# EAGLE design LEDMatrixLearningBadge (EAGLE 6.5.0)
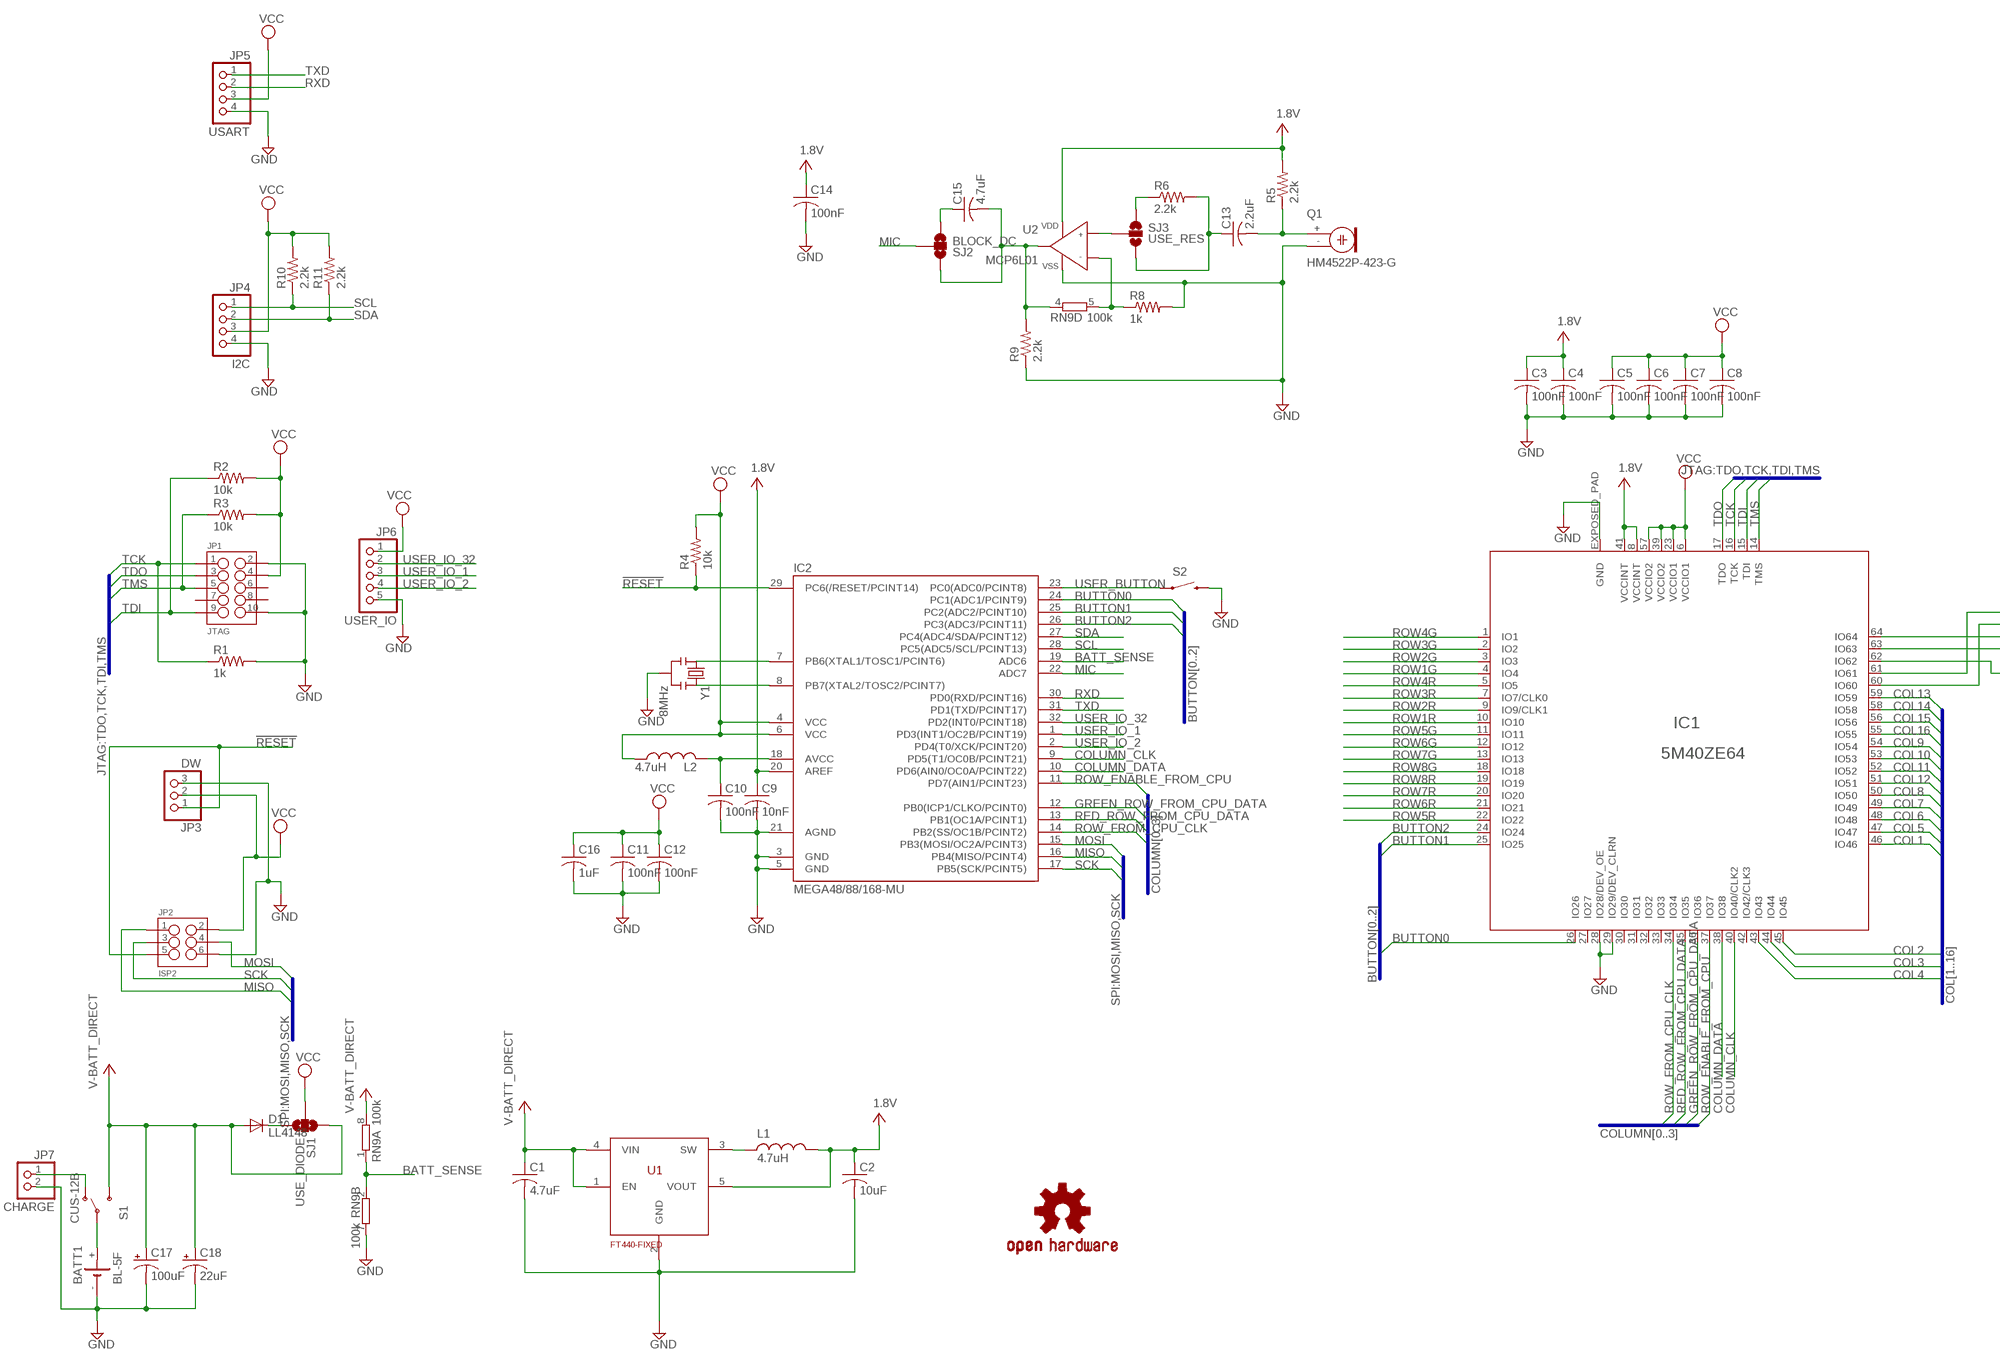
[diagram p0: schematic, sheet 1, part 1 of 2]
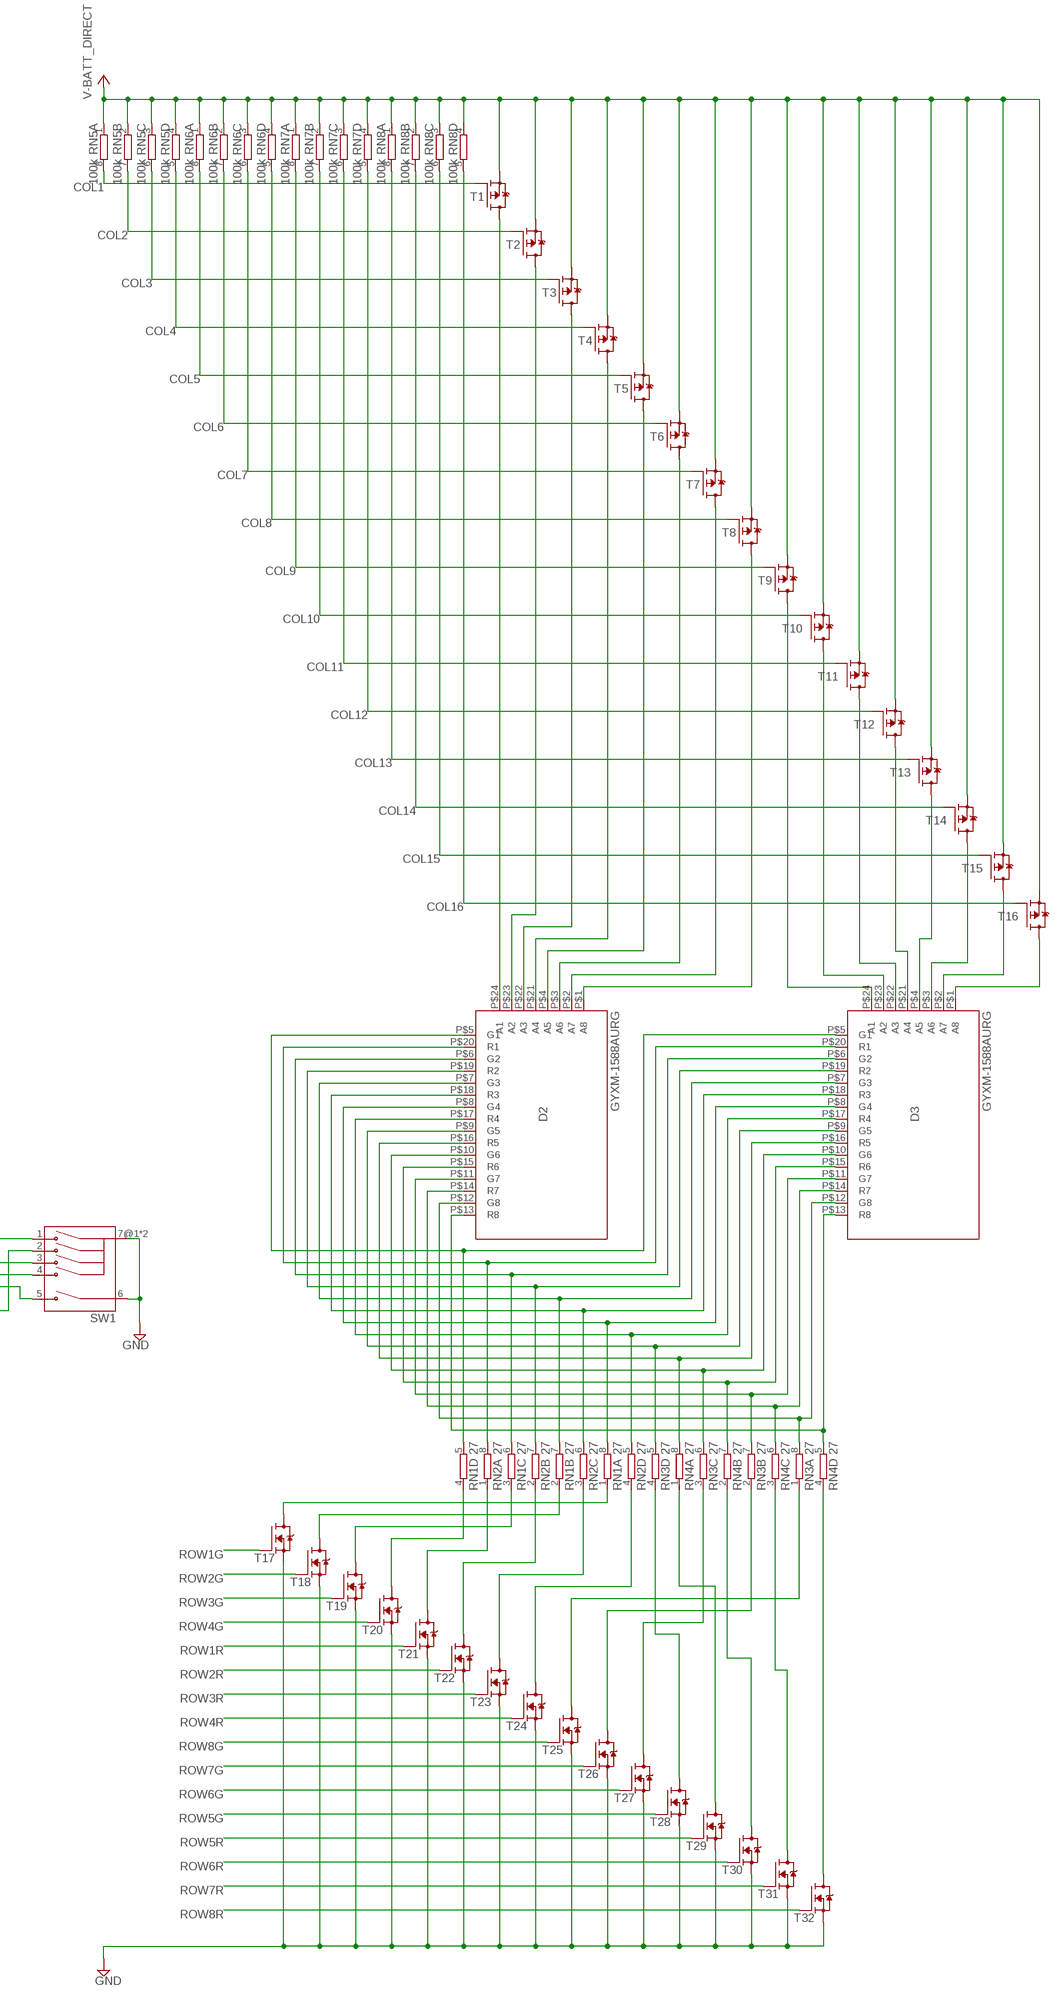
[diagram p1: schematic, sheet 1, part 2 of 2]

## Parts
BATT1  BL-5F  1C  [NOKIA_BL-5F_INCL_HOLDER]
C1  4.7uF  C-USC0603  [C0603]
C2  10uF  C0508  [C0508]
C3  100nF  C-USC0603  [C0603]
C4  100nF  C-USC0603  [C0603]
C5  100nF  C-USC0603  [C0603]
C6  100nF  C-USC0603  [C0603]
C7  100nF  C-USC0603  [C0603]
C8  100nF  C-USC0603  [C0603]
C9  10nF  C-USC0603  [C0603]
C10  100nF  C-USC0603  [C0603]
C11  100nF  C-USC0603  [C0603]
C12  100nF  C-USC0603  [C0603]
C13  2.2uF  C-USC0603  [C0603]
C14  100nF  C-USC0603  [C0603]
C15  4.7uF  C-USC0603  [C0603]
C16  1uF  C-USC0603  [C0603]
C17  100uF  CPOL-USC/6032-28R  [C/6032-28R]
C18  22uF  CPOL-USD/7343-31R  [D/7343-31R]
D1  LL4148  DIODE-SOD80C  [SOD80C]
D2  GYXM-1588AURG  [GYXM-1588AURG]
D3  GYXM-1588AURG  [GYXM-1588AURG]
IC1  5M40ZE64  [EQFP64]
IC2  MEGA48/88/168-MU  [MLF32]
JP1  JTAG  M05X2  [2X5_POGO]
JP2  ISP2  M03X2POGO_PINS  [2X3_POGO]
JP3  DW  PINHD-1X3  [1X03]
JP4  I2C  PINHD-1X4  [1X04]
JP5  USART  PINHD-1X4  [1X04]
JP6  USER_IO  PINHD-1X5  [1X05]
JP7  CHARGE  PINHD-1X2  [1X02]
L1  4.7uH  INDUCTOR0603  [0603]
L2  4.7uH  INDUCTOR0603  [0603]
LOGO1  OSHW-LOGOS  [OSHW-LOGO-S]
Q1  HM4522P-423-G  ELECTRET4.5MM  [4.5ELECTRET]
R1  1k  R-US_R0603  [R0603]
R2  10k  R-US_R0603  [R0603]
R3  10k  R-US_R0603  [R0603]
R4  10k  R-US_R0603  [R0603]
R5  2.2k  R-US_R0603  [R0603]
R6  2.2k  R-US_R0603  [R0603]
R8  1k  R-US_R0603  [R0603]
R9  2.2k  R-US_R0603  [R0603]
R10  2.2k  R-US_R0603  [R0603]
R11  2.2k  R-US_R0603  [R0603]
RN1  27  4R-N0603-ARV  [0603-ARV]
RN2  27  4R-N0603-ARV  [0603-ARV]
RN3  27  4R-N0603-ARV  [0603-ARV]
RN4  27  4R-N0603-ARV  [0603-ARV]
RN5  100k  4R-N0603-ARV  [0603-ARV]
RN6  100k  4R-N0603-ARV  [0603-ARV]
RN7  100k  4R-N0603-ARV  [0603-ARV]
RN8  100k  4R-N0603-ARV  [0603-ARV]
RN9  100k  4R-N0603-ARV  [0603-ARV]
S1  CUS-12B  SWITCH-SPDT-SMD-A  [SWITCH-SPST-SMD-A]
S2  SWITCH-MOMENTARY-212MM  [TACTILE-PTH-12MM]
SJ1  USE_DIODE  SOLDERJUMPER_2WAYPASTE1&2  [SJ_3_PASTE1&2]
SJ2  BLOCK_DC  SOLDERJUMPER_2WAYPASTE1&2  [SJ_3_PASTE1&2]
SJ3  USE_RES  SOLDERJUMPER_2WAYPASTE1&2  [SJ_3_PASTE1&2]
SW1  4_DIRECTIONAL_JOYSTICK_PLUS_CENTER  [EVQWH]
T1  ZXM61P03  P-MOSFET  [SOT23]
T2  ZXM61P03  P-MOSFET  [SOT23]
T3  ZXM61P03  P-MOSFET  [SOT23]
T4  ZXM61P03  P-MOSFET  [SOT23]
T5  ZXM61P03  P-MOSFET  [SOT23]
T6  ZXM61P03  P-MOSFET  [SOT23]
T7  ZXM61P03  P-MOSFET  [SOT23]
T8  ZXM61P03  P-MOSFET  [SOT23]
T9  ZXM61P03  P-MOSFET  [SOT23]
T10  ZXM61P03  P-MOSFET  [SOT23]
T11  ZXM61P03  P-MOSFET  [SOT23]
T12  ZXM61P03  P-MOSFET  [SOT23]
T13  ZXM61P03  P-MOSFET  [SOT23]
T14  ZXM61P03  P-MOSFET  [SOT23]
T15  ZXM61P03  P-MOSFET  [SOT23]
T16  ZXM61P03  P-MOSFET  [SOT23]
T17  DMN65D8L  N-MOSFET  [SOT23]
T18  DMN65D8L  N-MOSFET  [SOT23]
T19  DMN65D8L  N-MOSFET  [SOT23]
T20  DMN65D8L  N-MOSFET  [SOT23]
T21  DMN65D8L  N-MOSFET  [SOT23]
T22  DMN65D8L  N-MOSFET  [SOT23]
T23  DMN65D8L  N-MOSFET  [SOT23]
T24  DMN65D8L  N-MOSFET  [SOT23]
T25  DMN65D8L  N-MOSFET  [SOT23]
T26  DMN65D8L  N-MOSFET  [SOT23]
T27  DMN65D8L  N-MOSFET  [SOT23]
T28  DMN65D8L  N-MOSFET  [SOT23]
T29  DMN65D8L  N-MOSFET  [SOT23]
T30  DMN65D8L  N-MOSFET  [SOT23]
T31  DMN65D8L  N-MOSFET  [SOT23]
T32  DMN65D8L  N-MOSFET  [SOT23]
U1  FT440-FIXED  [SOT23-5]
U2  MCP6L01  [SOT23-5]
Y1  8MHz  RESONATOR  [RESONATOR-SMD]

## Nets
1.8V: C2.P$1 C3.1 C4.1 C9.1 C14.1 IC1.8(VCCINT) IC1.41(VCCINT) IC2.20(AREF) L1.2 R5.2 U1.5(VOUT) U2.P5(VDD)
!RESET: IC2.29(PC6(/RESET/PCINT14)) JP2.P$5 JP3.1 R4.1
+V-BATT_DIRECT: C1.1 C17.+ C18.+ D1.A RN5.1 RN5.2 RN5.3 RN5.4 RN6.1 RN6.2 RN6.3 RN6.4 RN7.1 RN7.2 RN7.3 RN7.4 RN8.1 RN8.2 RN8.3 RN8.4 RN9.8 S1.3(S) SJ1.1 T1.2(S) T2.2(S) T3.2(S) T4.2(S) T5.2(S) T6.2(S) T7.2(S) T8.2(S) T9.2(S) T10.2(S) T11.2(S) T12.2(S) T13.2(S) T14.2(S) T15.2(S) T16.2(S) U1.1(EN) U1.4(VIN) ; supply symbol labelled V-BATT_DIRECT
BATT_SENSE: IC2.19(ADC6) RN9.1 RN9.2
BUTTON0: IC1.26(IO26) IC2.24(PC1(ADC1/PCINT9))
BUTTON1: IC1.25(IO25) IC2.25(PC2(ADC2/PCINT10))
BUTTON2: IC1.24(IO24) IC2.26(PC3(ADC3/PCINT11))
COL1: IC1.46(IO46) RN5.8 T1.1(G)
COL2: IC1.45(IO45) RN5.7 T2.1(G)
COL3: IC1.44(IO44) RN5.6 T3.1(G)
COL4: IC1.43(IO43) RN5.5 T4.1(G)
COL5: IC1.47(IO47) RN6.8 T5.1(G)
COL6: IC1.48(IO48) RN6.7 T6.1(G)
COL7: IC1.49(IO49) RN6.6 T7.1(G)
COL8: IC1.50(IO50) RN6.5 T8.1(G)
COL9: IC1.54(IO54) RN7.8 T9.1(G)
COL10: IC1.53(IO53) RN7.7 T10.1(G)
COL11: IC1.52(IO52) RN7.6 T11.1(G)
COL12: IC1.51(IO51) RN7.5 T12.1(G)
COL13: IC1.59(IO59) RN8.8 T13.1(G)
COL14: IC1.58(IO58) RN8.7 T14.1(G)
COL15: IC1.56(IO56) RN8.6 T15.1(G)
COL16: IC1.55(IO55) RN8.5 T16.1(G)
COLUMN_CLK: IC1.40(IO40/CLK2) IC2.9(PD5(T1/OC0B/PCINT21))
COLUMN_DATA: IC1.38(IO38) IC2.10(PD6(AIN0/OC0A/PCINT22))
GND: BATT1.- C1.2 C2.P$2 C3.2 C4.2 C5.2 C6.2 C7.2 C8.2 C9.2 C10.2 C11.2 C12.2 C14.2 C16.2 C17.- C18.- IC1.28(IO28/DEV_OE) IC1.29(IO29/DEV_CLRN) IC1.EXPOSED_PAD(GND) IC2.3(GND) IC2.5(GND) IC2.21(AGND) JP1.P$2 JP1.P$10 JP2.P$6 JP3.3 JP4.4 JP5.4 JP6.5 JP7.2 Q1.- R1.2 R8.2 R9.1 RN9.7 S2.3 SW1.6 SW1.7@1 SW1.7@2 T17.2(S) T18.2(S) T19.2(S) T20.2(S) T21.2(S) T22.2(S) T23.2(S) T24.2(S) T25.2(S) T26.2(S) T27.2(S) T28.2(S) T29.2(S) T30.2(S) T31.2(S) T32.2(S) U1.2(GND) U2.P2(VSS) Y1.2
GREEN_ROW_FROM_CPU_DATA: IC1.36(IO36) IC2.12(PB0(ICP1/CLKO/PCINT0))
MIC: IC2.22(ADC7) SJ2.2
MISO: IC2.16(PB4(MISO/PCINT4)) JP2.P$1
MOSI: IC2.15(PB3(MOSI/OC2A/PCINT3)) JP2.P$4
N$1: SJ3.2 U2.P3(IN+)
N$2: C13.2 Q1.+ R5.1
N$3: R6.1 SJ3.1
N$4: R8.1 RN9.5 U2.P4(IN-)
N$5: C15.1 SJ2.3
N$6: C15.2 R9.2 RN9.4 SJ2.1 U2.P1(OUT)
N$7: C13.1 R6.2 SJ3.3
N$8: D2.P$1(A8) T8.3(D)
N$9: D1.C SJ1.3
N$10: L1.1 U1.3(SW)
N$11: C10.1 IC2.18(AVCC) L2.2
N$12: D2.P$2(A7) T7.3(D)
N$13: D2.P$3(A6) T6.3(D)
N$14: D2.P$4(A5) T5.3(D)
N$15: D2.P$21(A4) T4.3(D)
N$16: D2.P$22(A3) T3.3(D)
N$17: D2.P$23(A2) T2.3(D)
N$18: D2.P$24(A1) T1.3(D)
N$19: D3.P$24(A1) T9.3(D)
N$20: D3.P$1(A8) T16.3(D)
N$21: D3.P$2(A7) T15.3(D)
N$22: D3.P$3(A6) T14.3(D)
N$23: D3.P$4(A5) T13.3(D)
N$24: D3.P$21(A4) T12.3(D)
N$25: D3.P$22(A3) T11.3(D)
N$26: D3.P$23(A2) T10.3(D)
N$27: D2.P$13(R8) D3.P$13(R8) RN4.5
N$28: D2.P$12(G8) D3.P$12(G8) RN3.8
N$29: D2.P$14(R7) D3.P$14(R7) RN4.6
N$30: D2.P$11(G7) D3.P$11(G7) RN3.7
N$31: D2.P$15(R6) D3.P$15(R6) RN4.7
N$32: D2.P$10(G6) D3.P$10(G6) RN3.6
N$33: D2.P$16(R5) D3.P$16(R5) RN4.8
N$34: D2.P$9(G5) D3.P$9(G5) RN3.5
N$35: D2.P$17(R4) D3.P$17(R4) RN2.5
N$36: D2.P$8(G4) D3.P$8(G4) RN1.8
N$37: D2.P$18(R3) D3.P$18(R3) RN2.6
N$38: D2.P$7(G3) D3.P$7(G3) RN1.7
N$39: D2.P$19(R2) D3.P$19(R2) RN2.7
N$40: D2.P$6(G2) D3.P$6(G2) RN1.6
N$41: D2.P$20(R1) D3.P$20(R1) RN2.8
N$42: D2.P$5(G1) D3.P$5(G1) RN1.5
N$43: BATT1.+ S1.2(P)
N$44: IC1.64(IO64) SW1.3
N$45: IC1.63(IO63) SW1.4
N$46: IC1.62(IO62) SW1.5
N$47: IC1.60(IO60) SW1.2
N$48: IC1.61(IO61) SW1.1
N$49: RN4.4 T32.3(D)
N$50: IC2.7(PB6(XTAL1/TOSC1/PCINT6)) Y1.1
N$51: IC2.8(PB7(XTAL2/TOSC2/PCINT7)) Y1.3
N$52: JP7.1 S1.1(O)
N$60: RN4.3 T31.3(D)
N$61: RN4.2 T30.3(D)
N$62: RN4.1 T29.3(D)
N$63: RN3.4 T28.3(D)
N$64: RN3.3 T27.3(D)
N$65: RN3.2 T26.3(D)
N$66: RN3.1 T25.3(D)
N$67: RN2.4 T24.3(D)
N$68: RN2.3 T23.3(D)
N$69: RN2.2 T22.3(D)
N$70: RN2.1 T21.3(D)
N$71: RN1.4 T20.3(D)
N$72: RN1.3 T19.3(D)
N$73: RN1.2 T18.3(D)
N$74: RN1.1 T17.3(D)
RED_ROW_FROM_CPU_DATA: IC1.35(IO35) IC2.13(PB1(OC1A/PCINT1))
ROW1G: IC1.4(IO4) T17.1(G)
ROW1R: IC1.10(IO10) T21.1(G)
ROW2G: IC1.3(IO3) T18.1(G)
ROW2R: IC1.9(IO9/CLK1) T22.1(G)
ROW3G: IC1.2(IO2) T19.1(G)
ROW3R: IC1.7(IO7/CLK0) T23.1(G)
ROW4G: IC1.1(IO1) T20.1(G)
ROW4R: IC1.5(IO5) T24.1(G)
ROW5G: IC1.11(IO11) T28.1(G)
ROW5R: IC1.22(IO22) T29.1(G)
ROW6G: IC1.12(IO12) T27.1(G)
ROW6R: IC1.21(IO21) T30.1(G)
ROW7G: IC1.13(IO13) T26.1(G)
ROW7R: IC1.20(IO20) T31.1(G)
ROW8G: IC1.18(IO18) T25.1(G)
ROW8R: IC1.19(IO19) T32.1(G)
ROW_ENABLE_FROM_CPU: IC1.37(IO37) IC2.11(PD7(AIN1/PCINT23))
ROW_FROM_CPU_CLK: IC1.34(IO34) IC2.14(PB2(SS/OC1B/PCINT2))
RXD: IC2.30(PD0(RXD/PCINT16)) JP5.2
SCK: IC2.17(PB5(SCK/PCINT5)) JP2.P$3
SCL: IC2.28(PC5(ADC5/SCL/PCINT13)) JP4.1 R10.1
SDA: IC2.27(PC4(ADC4/SDA/PCINT12)) JP4.2 R11.1
TCK: IC1.16(TCK) JP1.P$1 R1.1
TDI: IC1.15(TDI) JP1.P$9 R2.1
TDO: IC1.17(TDO) JP1.P$3
TMS: IC1.14(TMS) JP1.P$5 R3.1
TXD: IC2.31(PD1(TXD/PCINT17)) JP5.1
USER_BUTTON: IC2.23(PC0(ADC0/PCINT8)) S2.1
USER_IO_1: IC2.1(PD3(INT1/OC2B/PCINT19)) JP6.3
USER_IO_2: IC2.2(PD4(T0/XCK/PCINT20)) JP6.4
USER_IO_32: IC2.32(PD2(INT0/PCINT18)) JP6.2
VCC: C5.1 C6.1 C7.1 C8.1 C11.1 C12.1 C16.1 IC1.6(VCCIO1) IC1.23(VCCIO1) IC1.39(VCCIO2) IC1.57(VCCIO2) IC2.4(VCC) IC2.6(VCC) JP1.P$4 JP2.P$2 JP3.2 JP4.3 JP5.3 JP6.1 L2.1 R2.2 R3.2 R4.2 R10.2 R11.2 SJ1.2
Unconnected: IC1.27(IO27) IC1.30(IO30) IC1.31(IO31) IC1.32(IO32) IC1.33(IO33) IC1.42(IO42/CLK3) JP1.P$6 JP1.P$7 JP1.P$8 RN9.3 RN9.6

## Buses
SPI:MOSI,MISO,SCK
JTAG:TDO,TCK,TDI,TMS
COLUMN[0..3]
BUTTON[0..2]
COL[1..16]

## Library data of the parts
BATT1 = Battery_Custom:1C
C1 C3-C16 = rcl:C-US: CAPACITOR, American symbol
C2 = rsim_RCL:C0508
C17 C18 = rcl:CPOL-US: POLARIZED CAPACITOR, American symbol
D1 = diode:DIODE-: DIODE
D2 D3 = Display_Custom:GYXM-1588AURG
IC1 = CPLD_FPGA_Custom:5M40ZE64: 5M40ZE64 edit this description Auto generated by make-symbol-device-package-bsdl.ulp Rev. 43 Source: 5M40ZE64.bsd
IC2 = atmel:MEGA48/88/168
JP1 = Conn_Header_Custom:M05X2
JP2 = SparkFun-Connectors:M03X2: 2x3 .1" header. Shrouded, with keying- CONN-10681 SMT- CONN-11415 Pogo pins- HW-11044; PROD_ID: HW-11044
JP3 = pinhead:PINHD-1X3: PIN HEADER
JP4 JP5 = pinhead:PINHD-1X4: PIN HEADER
JP6 = pinhead:PINHD-1X5: PIN HEADER
JP7 = pinhead:PINHD-1X2: PIN HEADER
L1 L2 = SparkFun-Passives:INDUCTOR: Inductors Basic Inductor/Choke - 0603 and 1206. Footprints are not proven and vary greatly between part numbers.
LOGO1 = SparkFun-Aesthetics:OSHW-LOGO: Open Source Hardware Logo This logo indicates the piece of hardware it is found on incorporates a OSHW license and/or adheres to the definition of open source hardware found here: http://freedomdefined.org/OSHW
Q1 = Electromechanical_Custom:ELECTRET: Electret microphone Thru hole 2.54mm spacing with 9.7mm diameter
R1-R6 R8-R11 = rcl:R-US_: RESISTOR, American symbol
RN1-RN9 = RCL_Custom:4R-N: Array Chip Resistor Source: RS Component / Phycomp; OC_FARNELL: unknown; OC_NEWARK: unknown
S1 = SparkFun-Electromechanical:SWITCH-SPDT: SPDT Switch Simple slide switch, Spark Fun Electronics SKU : COM-00102 DPDT SMT slide switch, AYZ0202, SWCH-08179
S2 = SparkFun-Electromechanical:SWITCH-MOMENTARY-2: Various NO switches- pushbuttons, reed, etc
SJ1-SJ3 = SparkFun-Passives:SOLDERJUMPER_2WAY: Solder Jumper 2 way solder jumper
SW1 = Electromechanical_Custom:4_DIRECTIONAL_JOYSTICK_PLUS_CENTER
T1-T16 = Transistor_Custom:P-MOSFET
T17-T32 = Transistor_Custom:N-MOSFET
U1 = VReg_Custom:FT440-FIXED
U2 = IC_Custom:MCP6L01
Y1 = Crystal_Custom:RESONATOR: Resonator Small SMD resonator. Used, eg, on the Arduino Pro/ Pro Mini boards. 8MHz- XTAL-08895 16MHz- XTAL-08900

## Board
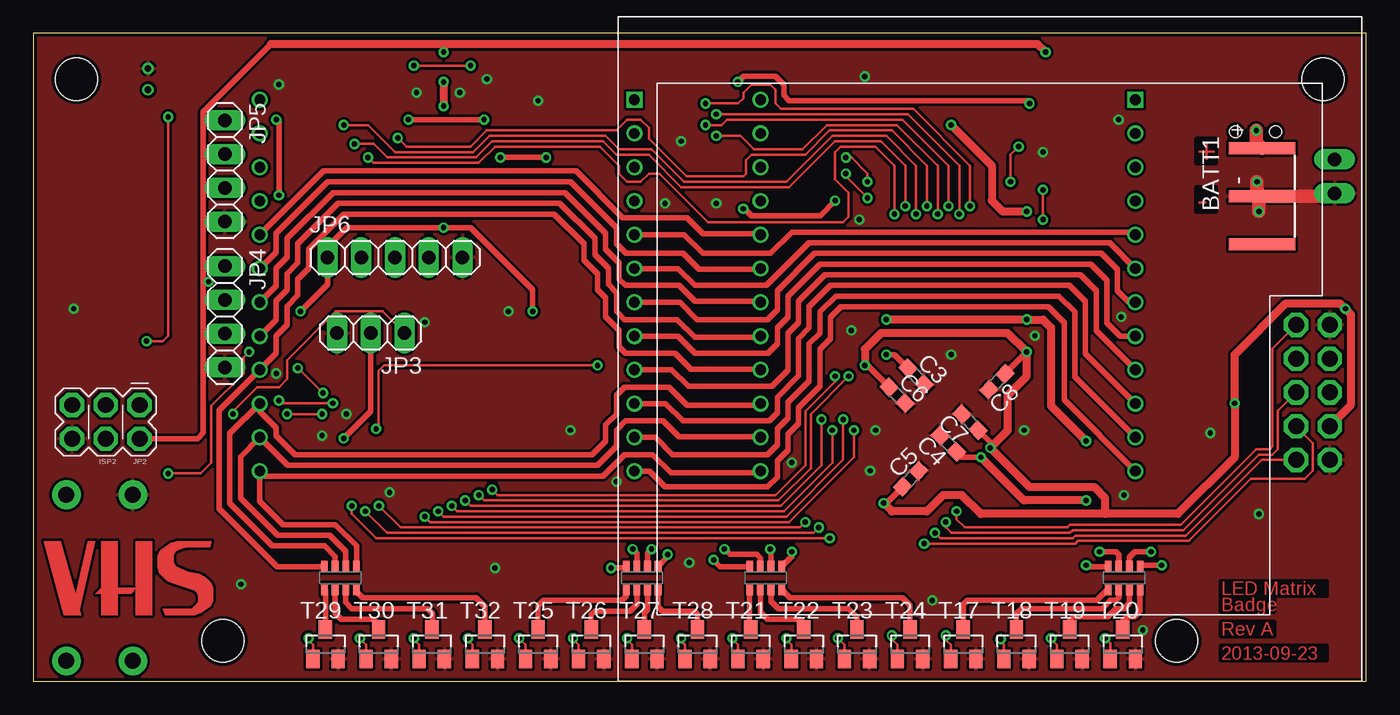
[diagram p2: board, top side]
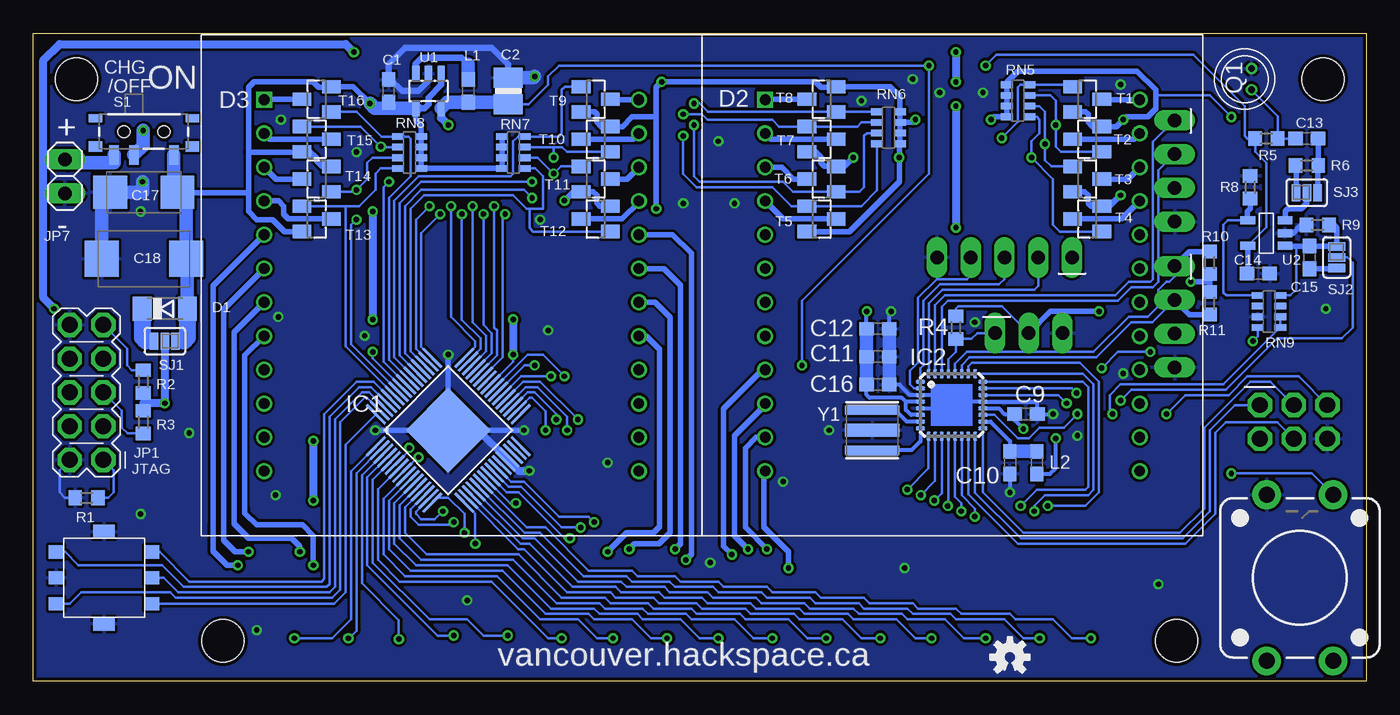
[diagram p3: board, bottom side, seen from below]

Size 100.33 x 48.77 mm. Coordinates in mm from the lower left corner, seen from the top.
Outline: 0,0 100.33,0 100.33,48.77 0,48.77 0,0
Copper layers (1*16): Top 0.0356mm / dielectric 1.5011mm / Bottom 0.0356mm
Design rules "LaenPCBOrder *": minimum track width 7.5mil, minimum drill 16mil, track to track 7.5mil, track to pad 7.5mil, pad to pad 7.5mil, via to via 7.5mil, smd to smd 7.5mil, copper to edge 10mil, drill to drill 8mil, minimum pad ring 7mil, minimum via ring 7mil, stop-mask expansion 4mil, vias tented up to drill 0mil, thermal gap 8mil
Holes 3.2 mm at 14.27,3.05 3.25,45.31 97.08,45.31 86.06,3.05

### Footprints (pad centres in the part's own frame; a part is rotated, then mirrored left to right if it is on the bottom)
NOKIA_BL-5F_INCL_HOLDER = smd 0.9 x 5: + -15.1,22.5; - -11.5,22.5; BSI -7.9,22.5
C0603 = smd 1.1 x 1: 1 -0.85,0; 2 0.85,0
C0508 = smd 1.5 x 2.2: P$1 -1,0; P$2 1,0
C/6032-28R = smd 2.55 x 2.5: + 2.525,0; - -2.525,0
D/7343-31R = smd 2.55 x 2.7: + 3.175,0; - -3.175,0
SOD80C = smd 1.4 x 1.8: A 1.7,0; C -1.7,0
GYXM-1588AURG = drill 0.8 square: P$1 -13.97,-14.1 | drill 0.8: P$2 -11.43,-14.1; P$3 -8.89,-14.1; P$4 -6.35,-14.1; P$5 -3.81,-14.1; P$6 -1.27,-14.1; P$7 1.27,-14.1; P$8 3.81,-14.1; P$9 6.35,-14.1; P$10 8.89,-14.1; P$11 11.43,-14.1; P$12 13.97,-14.1; P$13 13.97,14.1; P$14 11.43,14.1; P$15 8.89,14.1; P$16 6.35,14.1; P$17 3.81,14.1; P$18 1.27,14.1; P$19 -1.27,14.1; P$20 -3.81,14.1; P$21 -6.35,14.1; P$22 -8.89,14.1; P$23 -11.43,14.1; P$24 -13.97,14.1
EQFP64 = smd 2 x 0.2: 1 -4.7,3; 2 -4.7,2.6; 3 -4.7,2.2; 4 -4.7,1.8; 5 -4.7,1.4; 6 -4.7,1; 7 -4.7,0.6; 8 -4.7,0.2; 9 -4.7,-0.2; 10 -4.7,-0.6; 11 -4.7,-1; 12 -4.7,-1.4; 13 -4.7,-1.8; 14 -4.7,-2.2; 15 -4.7,-2.6; 16 -4.7,-3; 33 4.7,-3; 34 4.7,-2.6; 35 4.7,-2.2; 36 4.7,-1.8; 37 4.7,-1.4; 38 4.7,-1; 39 4.7,-0.6; 40 4.7,-0.2; 41 4.7,0.2; 42 4.7,0.6; 43 4.7,1; 44 4.7,1.4; 45 4.7,1.8; 46 4.7,2.2; 47 4.7,2.6; 48 4.7,3 | smd 0.2 x 2: 17 -3,-4.7; 18 -2.6,-4.7; 19 -2.2,-4.7; 20 -1.8,-4.7; 21 -1.4,-4.7; 22 -1,-4.7; 23 -0.6,-4.7; 24 -0.2,-4.7; 25 0.2,-4.7; 26 0.6,-4.7; 27 1,-4.7; 28 1.4,-4.7; 29 1.8,-4.7; 30 2.2,-4.7; 31 2.6,-4.7; 32 3,-4.7; 49 3,4.7; 50 2.6,4.7; 51 2.2,4.7; 52 1.8,4.7; 53 1.4,4.7; 54 1,4.7; 55 0.6,4.7; 56 0.2,4.7; 57 -0.2,4.7; 58 -0.6,4.7; 59 -1,4.7; 60 -1.4,4.7; 61 -1.8,4.7; 62 -2.2,4.7; 63 -2.6,4.7; 64 -3,4.7 | smd 4.5 x 4.5: EXPOSED_PAD 0,0
MLF32 = smd 0.7 x 0.3: 1 -2.35,1.75; 2 -2.35,1.25; 3 -2.35,0.75; 4 -2.35,0.25; 5 -2.35,-0.25; 6 -2.35,-0.75; 7 -2.35,-1.25; 8 -2.35,-1.75; 17 2.35,-1.75; 18 2.35,-1.25; 19 2.35,-0.75; 20 2.35,-0.25; 21 2.35,0.25; 22 2.35,0.75; 23 2.35,1.25; 24 2.35,1.75 | smd 0.3 x 0.7: 9 -1.75,-2.35; 10 -1.25,-2.35; 11 -0.75,-2.35; 12 -0.25,-2.35; 13 0.25,-2.35; 14 0.75,-2.35; 15 1.25,-2.35; 16 1.75,-2.35; 25 1.75,2.35; 26 1.25,2.35; 27 0.75,2.35; 28 0.25,2.35; 29 -0.25,2.35; 30 -0.75,2.35; 31 -1.25,2.35; 32 -1.75,2.35
2X5_POGO = drill 1.2 pad 1.829 octagon: P$1 -5.08,-1.27; P$2 -5.08,1.27; P$3 -2.54,-1.27; P$4 -2.54,1.27; P$5 0,-1.27; P$6 0,1.27; P$7 2.54,-1.27; P$8 2.54,1.27; P$9 5.08,-1.27; P$10 5.08,1.27
2X3_POGO = drill 1.2 pad 1.829 octagon: P$1 0,0; P$2 0,2.54; P$3 2.54,0; P$4 2.54,2.54; P$5 5.08,0; P$6 5.08,2.54
1X03 = drill 1.016 long: 1 -2.54,0; 2 0,0; 3 2.54,0
1X04 = drill 1.016 long: 1 -3.81,0; 2 -1.27,0; 3 1.27,0; 4 3.81,0
1X05 = drill 1.016 long: 1 -5.08,0; 2 -2.54,0; 3 0,0; 4 2.54,0; 5 5.08,0
1X02 = drill 1.016 long: 1 -1.27,0; 2 1.27,0
0603 = smd 1.1 x 1: 1 -0.85,0; 2 0.85,0
4.5ELECTRET = drill 0.5: + 0.8,0.5; - -0.8,0.5
R0603 = smd 1 x 1.1: 1 -0.85,0; 2 0.85,0
0603-ARV = smd 0.5 x 0.9: 1 -1.2,-0.85; 2 -0.4,-0.85; 3 0.4,-0.85; 4 1.2,-0.85; 5 1.2,0.85; 6 0.4,0.85; 7 -0.4,0.85; 8 -1.2,0.85
SWITCH-SPST-SMD-A = smd 0.7 x 1.5: 1 -2.25,-1.75; 2 -0.75,-1.75; 3 2.25,-1.75 | smd 1 x 0.6: GND1 -3.65,1; GND3 3.65,1 | smd 1 x 0.8: GND2 -3.65,-1.1; GND4 3.65,-1.1 | hole 0.9: -1.5,0; 1.5,0
TACTILE-PTH-12MM = drill 1.2 pad 2.159: 1 6.25,-2.5; 2 -6.25,-2.5; 3 6.25,2.5; 4 -6.25,2.5
SJ_3_PASTE1&2 = smd 0.635 x 1.27: 1 -0.813,0; 2 0,0; 3 0.813,0
EVQWH = smd 1.1 x 1: 1 -3.6,1.95; 2 3.6,1.95; 3 3.6,-1.95; 4 -3.6,-1.95; 5 3.6,0; 6 -3.6,0 | smd 1.6 x 1: 7@1 0,3.475; 7@2 0,-3.475
SOT23 = smd 1 x 1.4: 1 -0.95,-1.1; 2 0.95,-1.1; 3 0,1.1
SOT23-5 = smd 0.55 x 1.2: 1 -0.95,-1.3; 2 0,-1.3; 3 0.95,-1.3; 4 0.95,1.3; 5 -0.95,1.3
SOT23-5' = smd 1.1 x 0.6: P1 -1.4,0.95; P2 -1.4,0; P3 -1.4,-0.95; P4 1.4,-0.95; P5 1.4,0.95
RESONATOR-SMD = smd 0.7 x 4.1: 1 -1.5,0; 3 1.5,0 | smd 1 x 4.1: 2 0,0

### Placement (x,y rotation side)
BATT1  70,25 270 top
C1  73.58,44.42 90 bottom
C2  64.58,44.42 90 bottom
C3  66.45,22.96 315 top
C4  68.88,17.88 135 top
C5  66.04,15.24 45 top
C6  65.02,21.54 315 top
C7  70.51,19.51 135 top
C8  72.54,22.56 225 top
C9  25.6,20.12 0 bottom
C10  26.82,16.46 270 bottom
C11  36.76,24.43 0 bottom
C12  36.76,26.53 0 bottom
C13  4.47,40.84 180 bottom
C14  8.13,30.68 0 bottom
C15  4.27,31.9 90 bottom
C16  36.76,22.33 0 bottom
C17  92,36.8 0 bottom
C18  92,31.8 0 bottom
D1  90.42,28.04 0 bottom
D2  31.15,29.8 270 bottom
D3  68.85,29.8 270 bottom
IC1  69.09,18.9 45 bottom
IC2  31.2,20.8 0 bottom
JP1  96.32,21.74 90 bottom
JP2  8,20.8 180 top
JP3  25.4,26.21 180 top
JP4  14.43,27.43 270 top
JP5  14.43,38.4 270 top
JP6  27.23,31.9 0 top
JP7  97.94,38 270 bottom
L1  67.58,44.42 270 bottom
L2  24.79,16.46 90 bottom
LOGO1  26.82,1.83 0 bottom
Q1  9.14,45.31 270 bottom
R1  96.32,13.82 180 bottom
R2  92.05,22.56 270 bottom
R3  92.05,19.51 90 bottom
R4  30.89,26.62 90 bottom
R5  7.52,40.84 180 bottom
R6  4.47,38.81 0 bottom
R8  8.74,37.19 90 bottom
R9  3.66,34.34 0 bottom
R10  11.79,31.5 270 bottom
R11  11.79,28.45 90 bottom
RN1  82.1,7.8 0 top
RN2  55.12,7.8 0 top
RN3  45.83,7.8 0 top
RN4  23.12,7.8 0 top
RN5  26.21,43.69 270 bottom
RN6  35.97,41.66 90 bottom
RN7  64.19,39.8 270 bottom
RN8  72,39.8 90 bottom
RN9  7.32,27.84 90 bottom
S1  92,41.36 0 bottom
S2  5,7.8 90 bottom
SJ1  90.42,25.6 180 bottom
SJ2  2.24,31.9 270 bottom
SJ3  4.47,36.78 0 bottom
SW1  95,7.8 0 bottom
T1  21,43.8 270 bottom
T2  21,40.8 90 bottom
T3  21,37.8 270 bottom
T4  21,34.8 90 bottom
T5  41,34.8 270 bottom
T6  41,37.8 90 bottom
T7  41,40.8 270 bottom
T8  41,43.8 90 bottom
T9  58,43.8 270 bottom
T10  58,40.8 90 bottom
T11  58,37.8 270 bottom
T12  58,34.8 90 bottom
T13  79,34.8 270 bottom
T14  79,37.8 90 bottom
T15  79,40.8 270 bottom
T16  79,43.8 90 bottom
T17  70,2.8 0 top
T18  74,2.8 0 top
T19  78,2.8 0 top
T20  82,2.8 0 top
T21  54,2.8 0 top
T22  58,2.8 0 top
T23  62,2.8 0 top
T24  66,2.8 0 top
T25  38,2.8 0 top
T26  42,2.8 0 top
T27  46,2.8 0 top
T28  50,2.8 0 top
T29  22,2.8 0 top
T30  26,2.8 0 top
T31  30,2.8 0 top
T32  34,2.8 0 top
U1  70.58,44.42 180 bottom
U2  MCP6L01  [SOT23-5']  7.52,33.73 180 bottom
U$5  [VHS-SML]  7.11,7.72 0 top
Y1  37.19,18.9 270 bottom

### Tracks (layer width: path | path; a pad name or v marks a point on that pad's centre or on a via)
1.8V  (via drill 0.41, 0.41 pad 0.18)
  Top 0.203: v28.65,46.33 v32.92,46.33 | v42.47,23.77 26.42,23.77 26.01,23.37 26.01,19.2 v25.81,19
  Top 0.406: C3.1 64.82,24.59 v64.21,24.59 | C4.1 69.9,16.87 v71.32,16.87
  Top 0.61: v69.09,41.86 72.14,38.81 72.14,36.17 72.95,35.36 v74.78,35.36 | v64.21,27.23 v74.78,27.23 76,27.23 76.61,26.62 76.61,20.73 v79.25,18.09 | v79.25,13.61 74.57,13.61 v71.32,16.87
  Bottom 0.2: 64.73,43.57 C2.P$1
  Bottom 0.203: U2.P5 7.52,34.18 7.52,39.01 8.37,39.86 R5.2 8.94,40.84 9.14,41.05 9.14,43.28 13.01,47.14 27.84,47.14 v28.65,46.33 | IC1.8 71.4,16.87 v71.32,16.87 | IC1.41 64.21,24.06 v64.21,24.59 | C2.P$1 63.05,43.42 61.57,44.91 61.57,45.52 60.76,46.33 v32.92,46.33 32.92,38.2 42.47,28.65 v42.47,23.77
  Bottom 0.305: IC2.20 27.66,20.55 27.23,20.12 C9.1 26.45,19.65 v25.81,19
  Bottom 0.406: U2.P5 8.92,30.74 C14.1
  Bottom 0.61: U1.5 69.63,42.4 v69.09,41.86 | v74.78,35.36 v74.78,27.23 | v64.21,27.23 v64.21,24.59 | v79.25,18.09 v79.25,13.61
  Bottom 1: 64.73,43.57 L1.2 69.18,43.57 U1.5
!RESET  (via drill 0.41 pad 0.18)
  Top 0.203: v15.04,20.12 15.04,20.32 16.87,22.15 18.49,22.15 19.1,22.76 19.1,24.18 22.76,27.84 26.31,27.84 JP3.1
  Bottom 0.203: IC2.29 31.45,24.23 30.89,24.79 R4.1 29.7,25.77 29.26,26.21 JP3.1 | v15.04,20.12 13.61,21.54 10.36,21.54 8.94,22.96 5.08,22.96 JP2.P$5
+V-BATT_DIRECT  (via drill 0.41 pad 0.18)
  Top 0.203: v8.53,25.6 9.75,25.6 10.16,26.01 v10.16,42.47
  Top 0.406: v18.49,36.58 18.49,42.06 v18.29,42.27 | v28.25,42.27 v33.93,42.27 | v38.61,39.42 v35.15,39.42 | v60.35,36.17 59.23,35.05 54.05,35.05 53.54,35.56 v53.44,35.56 | v74.98,43.48 74.78,43.69 56.9,43.69 56.49,44.09 56.49,44.91 55.88,45.52 53.44,45.52 v53.03,45.11
  Bottom 0.203: RN9.8 8.16,25.97 v8.53,25.6 | v10.16,42.47 11.79,44.09 15.85,44.09
  Bottom 0.406: RN7.1 RN7.2 RN7.3 RN7.4 RN8.1 RN8.2 RN8.3 RN8.4 71.12,41.03 71.12,41.86 71.53,42.27 U1.4 | 89,25.6 SJ1.1 | v74.98,43.48 76.24,44.75 T16.2 77.94,44.7 78.84,44.7 79.25,45.11 83.72,45.11 84.12,44.7 84.12,39.83 | T14.2 78.57,38.75 79.05,39.22 79.05,39.42 79.47,39.85 T15.2 80.12,39.83 84.12,39.83 | T13.2 81.4,33.85 82.3,34.75 83.52,34.75 84.12,35.36 84.12,36.78 | 84.12,39.83 84.12,36.78 | T3.2 21.2,36.85 20.93,36.58 20.93,35.97 20.71,35.75 T4.2 19.32,35.75 v18.49,36.58 | T1.2 22.07,42.88 21.13,42.88 20.93,42.67 20.93,42.06 20.61,41.75 T2.2 18.81,41.75 v18.29,42.27 18.09,42.47 16.46,42.47 15.85,43.08 15.85,44.09 15.85,44.5 17.27,45.92 26.21,45.92 27.06,45.07 RN5.1 RN5.2 RN5.3 RN5.4 28.02,42.49 v28.25,42.27 | RN6.3 RN6.4 35.12,44.06 35.81,44.75 T8.2 39.94,44.7 41.05,44.7 41.45,45.11 v53.03,45.11 53.44,44.7 53.44,42.47 | RN6.3 RN6.2 RN6.1 35.15,40.42 v35.15,39.42 35.15,37.59 38.9,33.85 T5.2 | T7.2 41.47,39.85 41.05,39.42 41.05,39.01 40.78,38.75 T6.2 39.28,38.75 v38.61,39.42 | T9.2 58.09,42.85 57.91,42.67 57.91,42.06 57.6,41.75 T10.2 55.99,41.75 55.27,42.47 53.44,42.47 | T12.2 57.69,35.75 57.91,35.97 57.91,36.58 58.18,36.85 T11.2 59.67,36.85 v60.35,36.17 | v33.93,42.27 34.14,42.06 RN6.3 | v53.44,35.56 53.44,42.47 | 88.83,36.8 88.81,36.78 84.12,36.78
  Bottom 0.5: U1.4 70.88,43.12 70.58,43.42 70.58,43.92 69.63,44.87 U1.1
  Bottom 1: S1.3 89.75,36.8 C17.+ 88.83,36.8 C18.+ | U1.4 73.58,43.12 C1.1
  Bottom 1.016: 73.58,43.12 74.62,43.12 v74.98,43.48 | C18.+ 88.72,31.7 D1.A
  Bottom 1.27: D1.A 88.72,25.88 89,25.6
BATT_SENSE  (via drill 0.41 pad 0.18)
  Top 0.203: v21.74,20.12 v19.1,20.12
  Bottom 0.203: IC2.19 27.97,20.05 26.21,18.29 25.4,18.29 24.59,19.1 22.76,19.1 v21.74,20.12 | v19.1,20.12 19.3,20.32 19.3,21.54 18.49,22.35 10.77,22.35 6.48,26.64 | 6.48,26.64 RN9.1 | 6.48,26.64 6.46,26.66 RN9.2
BUTTON0  (via drill 0.41 pad 0.18)
  Top 0.203: v58.12,11.99 57.71,11.58 27.64,11.58 v26.01,13.21
  Bottom 0.203: IC1.26 64.38,15.04 63.4,15.04 60.76,12.39 58.52,12.39 v58.12,11.99 | IC2.24 21.33,22.55 20.93,22.15 20.93,14.63 21.13,14.43 24.79,14.43 v26.01,13.21
BUTTON1  (via drill 0.41 pad 0.18)
  Top 0.203: v59.13,11.58 58.73,11.18 26.62,11.18 v24.99,12.8
  Bottom 0.203: IC1.25 64.54,14.63 63.6,14.63 60.55,11.58 v59.13,11.58 | IC2.25 21.32,23.15 20.52,22.35 20.52,14.43 20.93,14.02 24.18,14.02 24.99,13.21 v24.99,12.8
BUTTON2  (via drill 0.41 pad 0.18)
  Top 0.203: v59.94,10.77 25.81,10.77 23.98,12.6 v23.98,13.21
  Bottom 0.203: IC1.24 64.7,14.22 63.8,14.22 60.35,10.77 v59.94,10.77 | IC2.26 29.95,23.7 29.67,23.98 21.54,23.98 20.12,22.55 20.12,14.22 21.13,13.21 v23.98,13.21
COL1  (via drill 0.41, 0.41 pad 0.18)
  Top 0.203: v67.26,35.76 67.26,38.81 64.62,41.45 59.94,41.45 58.12,39.62 54.05,39.62 53.65,39.22 53.65,38.2 53.44,38 49.17,38 46.33,40.84 46.33,41.66 45.72,42.27 44.7,42.27 43.89,41.45 34.14,41.45 32.92,40.23 28.09,40.23 v27.44,40.89
  Bottom 0.203: IC1.46 66.24,24.85 66.24,26.01 67.26,27.03 v67.26,35.76 | v27.44,40.89 26.21,42.11 26.21,44.7 26.03,44.89 RN5.8 22.24,44.89 T1.1
COL2  (via drill 0.41 pad 0.18)
  Top 0.203: v66.45,35.15 66.45,38.81 64.21,41.05 60.15,41.05 56.69,37.59 48.97,37.59 46.53,40.03 44.09,40.03 43.08,41.05 34.34,41.05 33.12,39.83 27.23,39.83 25.2,41.86 v23.37,41.86
  Bottom 0.203: IC1.45 65.84,24.69 65.84,26.21 66.45,26.82 v66.45,35.15 | T2.1 22.98,39.85 23.37,40.23 v23.37,41.86 23.37,43.69 23.77,44.09 RN5.7
COL3  (via drill 0.41 pad 0.18)
  Top 0.203: v65.63,35.76 65.63,38.81 63.8,40.64 60.35,40.64 56.9,37.19 48.77,37.19 46.33,39.62 43.89,39.62 42.88,40.64 34.54,40.64 33.33,39.42 26.62,39.42 25.6,40.44 v24.18,40.44
  Bottom 0.203: IC1.44 65.43,24.54 65.43,26.42 65.63,26.62 v65.63,35.76 | T3.1 23.71,38.75 24.18,39.22 v24.18,40.44 24.18,42.88 24.59,43.29 RN5.6
COL4  (via drill 0.41 pad 0.18)
  Top 0.203: v64.82,35.15 64.82,38.81 63.4,40.23 60.76,40.23 60.35,39.83 60.35,37.8 61.37,36.78 61.37,34.95 60.96,34.54 50.8,34.54 47.14,38.2 46.33,38.2 45.72,37.59 44.7,37.59 44.09,38.2 44.09,38.79 44.1,38.8 42.66,40.23 34.75,40.23 33.53,39.01 25.6,39.01 v25.2,39.42
  Bottom 0.203: IC1.43 65.02,24.38 65.02,34.95 v64.82,35.15 | T4.1 23.08,33.85 23.57,34.34 23.57,37.8 v25.2,39.42 25.2,40.64 24.59,41.25 24.59,42.27 24.81,42.49 RN5.5
COL5  (via drill 0.41 pad 0.18)
  Top 0.203: v68.07,35.15 68.07,38.81 65.02,41.86 59.74,41.86 57.91,40.03 54.25,40.03 53.24,41.05 v51.41,41.05
  Bottom 0.203: IC1.47 66.65,25.01 66.65,25.81 68.07,27.23 v68.07,35.15 | v51.41,41.05 51.41,38.2 50.39,37.19 44.7,37.19 43.27,35.75 T5.1 42.08,35.76 38,35.76 36.82,36.95 RN6.8
COL6  (via drill 0.41 pad 0.18)
  Top 0.203: v68.89,35.76 68.89,38.81 65.43,42.27 52.22,42.27 51.82,41.86 v50.6,41.86
  Bottom 0.203: IC1.48 67.06,25.17 67.06,25.6 68.89,27.43 v68.89,35.76 | v50.6,41.86 50.6,38 50.19,37.59 43.89,37.59 43.15,36.85 T6.1 38.13,36.85 37.8,37.19 37.8,41.05 37.59,41.26 RN6.7
COL7  (via drill 0.41 pad 0.18)
  Top 0.203: v69.7,35.15 69.7,38.81 65.84,42.67 v51.41,42.67
  Bottom 0.203: IC1.49 71.12,25.17 71.12,33.73 v69.7,35.15 | v51.41,42.67 49.99,42.67 49.58,42.27 44.7,42.27 44.19,41.75 T7.1 38.31,41.75 38.01,42.06 RN6.6
COL8  (via drill 0.41 pad 0.18)
  Top 0.203: v70.51,35.76 70.51,38.81 66.24,43.08 56.29,43.08 55.88,43.48 55.88,44.5 55.47,44.91 54.05,44.91 53.44,44.3 53.44,43.89 53.03,43.48 v50.6,43.48
  Bottom 0.203: IC1.50 71.53,25.01 71.53,34.75 v70.51,35.76 | v50.6,43.48 50.19,43.48 49.55,42.85 T8.1 RN6.5
COL9
  Bottom 0.203: IC1.54 73.15,24.38 73.15,36.17 71.32,38 64.41,38 64.21,38.2 64.21,40.64 63.85,41 RN7.8 60.81,41 60.55,41.25 60.55,44.5 60.31,44.75 T9.1
COL10  (via drill 0.41 pad 0.18)
  Top 0.203: v61.16,39.42 61.57,39.42 62.79,38.2 v62.79,37.59
  Bottom 0.203: IC1.53 72.75,24.54 72.75,35.97 71.12,37.59 v62.79,37.59 | RN7.7 61.16,40.2 | 61.16,40.2 60.52,40.2 60.17,39.85 T10.1 | v61.16,39.42 61.16,40.2
COL11  (via drill 0.41 pad 0.18)
  Top 0.203: v61.16,38.2 61.16,38 v62.79,36.37
  Bottom 0.203: IC1.52 72.34,24.69 72.34,35.76 71.12,36.98 63.4,36.98 v62.79,36.37 | RN7.6 62.36,39.4 v61.16,38.2 60.62,38.75 T11.1
COL12
  Bottom 0.203: IC1.51 71.93,24.85 71.93,35.56 70.92,36.58 64.21,36.58 63.2,35.56 62.99,35.56 | T12.1 62.7,33.85 62.99,34.14 62.99,35.56 | RN7.5 62.57,38.6 61.98,38 61.98,35.56 62.99,35.56
COL13
  Bottom 0.203: T13.1 76.81,35.75 | 76.81,35.75 75.81,35.75 74.57,36.98 74.57,38.2 74.18,38.6 RN8.8 | IC1.59 76.81,25.2 76.81,35.75
COL14  (via drill 0.41 pad 0.18)
  Top 0.203: v76,34.75 v76,36.98
  Bottom 0.203: RN8.7 74.8,39.4 75.18,39.01 75.18,37.8 v76,36.98 76.13,36.85 T14.1 | IC1.58 76.4,25.36 76.4,34.34 v76,34.75
COL15  (via drill 0.41 pad 0.18)
  Top 0.203: v73.56,37.59 73.56,39.62 v74.17,40.23
  Bottom 0.203: IC1.56 73.97,24.06 73.97,37.19 v73.56,37.59 | RN8.6 74.13,40.2 v74.17,40.23 75.68,41.75 T15.1
COL16
  Bottom 0.203: IC1.55 73.56,24.22 73.56,36.37 71.93,38 71.93,40.84 72.09,41 RN8.5 74.12,41 76,42.88 77.87,42.88 T16.1
COLUMN_CLK  (via drill 0.41 pad 0.18, 0.41 pad 0.41)
  Top 0.203: v34.54,14.43 34.95,14.02 55.88,14.02 58.12,16.26 58.12,20.32 60.35,22.55 v60.35,22.96
  Bottom 0.203: IC1.40 63.12,24.59 61.98,24.59 v60.35,22.96 | IC2.9 32.95,16.02 v34.54,14.43
COLUMN_DATA  (via drill 0.41 pad 0.18, 0.41 pad 0.41)
  Top 0.203: v33.53,14.02 33.93,13.61 56.08,13.61 58.52,16.05 58.52,20.12 v61.37,22.96
  Bottom 0.203: IC1.38 63.61,22.96 v61.37,22.96 | IC2.10 32.45,15.1 v33.53,14.02
GND  (via drill 0.41, 0.41 pad 0.18)
  Top 1.016: BATT1.- 92.1,36.9 v92.1,37.6 | BATT1.- 92.25,36.5 v92.25,35.36 | BATT1.- 97.71,36.5 JP7.2
  Bottom 0.2: C1.2 73.43,45.27
  Bottom 0.203: R1.2 97.94,13.82 98.35,14.22 98.35,15.9 JP1.P$2 | 24.79,20.15 C9.2 | IC1.28 64.64,16.7 IC1.29 | IC1.29
  Bottom 0.305: 24.79,20.15 24.79,20.93 24.91,21.05 IC2.21 32.22,21.05 32.31,21.13 | IC2.5 32.69,20.55 32.31,20.93 32.31,21.13 | 32.31,21.13 32.31,21.34 32.52,21.55 IC2.3 34.35,21.55 35.13,22.33 C16.2 | C12.2 35.91,27.7 v35.76,27.84 | C9.2 v23.57,20.12 | C10.2 v26.82,14.22
  Bottom 0.406: U2.P2 5.49,33.73 4.88,34.34 R9.1 | IC1.EXPOSED_PAD v63.4,18.9 | IC1.EXPOSED_PAD v69.09,24.59 | IC1.EXPOSED_PAD v74.57,18.9
  Bottom 0.5: 73.43,45.27 72.58,44.42 71.33,44.42 70.58,45.17 U1.2 | C2.P$2 64.58,46.42 65.83,47.67 72.33,47.67 73.58,46.42 C1.2
  Bottom 0.559: 66.84,18.9 64.64,16.7 63.79,15.85
  Bottom 0.61: 66.84,18.9 IC1.EXPOSED_PAD | 63.79,15.85 v62.99,15.85
  Bottom 1: C18.- 95.17,36.8 C17.- 92.1,36.8 v92.1,37.6 | C16.2 C11.2 C12.2
  Bottom 1.016: C2.P$2 62.68,45.42 v62.59,45.52
  other vias: 34.14,45.31 38,43.69 81.89,27.43 75.39,26.01 3.05,28.04 18.29,23.16 21.74,18.49 29.46,27.03 40.44,18.9 43.89,15.04 34.75,8.53 67.67,6.1 47.55,35.97 62.18,34.75 51.41,35.97 76,39.83 81.69,42.27 88.6,18.69 18.49,44.91 15.65,7.32 49.38,8.94 57.1,16.46 61.57,26.42 82.09,14.02 92.25,12.6 28.85,44.3 32.11,44.3 83.52,3.86 48.77,40.64
  pour Bottom (isolate 0.203): 0,0 100.33,0 100.33,48.77 0,48.77
  pour Top (isolate 0.203): 0,0 100.33,0 100.33,48.77 0,48.77
GREEN_ROW_FROM_CPU_DATA  (via drill 0.41 pad 0.18, 0.41 pad 0.41)
  Top 0.203: v31.5,13.21 31.9,12.8 56.49,12.8 60.15,16.46 v60.15,18.9
  Bottom 0.203: IC1.36 63.29,22.15 62.38,22.15 60.15,19.91 v60.15,18.9 | IC2.12 31.45,13.25 v31.5,13.21
MIC  (via drill 0.41 pad 0.18)
  Top 0.203: v22.55,20.93 18.69,20.93 v18.49,21.13
  Bottom 0.203: IC2.22 23.17,21.55 v22.55,20.93 | v18.49,21.13 17.68,21.95 10.57,21.95 6.71,25.81 1.83,25.81 1.02,26.62 1.02,31.5 1.42,31.9 SJ2.2
MISO
  Bottom 0.203: IC2.16 29.45,14.21 26.01,10.77 13.82,10.77 11.79,12.8 11.79,18.9 9.89,20.8 JP2.P$1
MOSI
  Bottom 0.203: IC2.15 29.95,14.1 26.21,10.36 13.61,10.36 11.38,12.6 11.38,18.69 10.57,19.51 6.71,19.51 JP2.P$4
N$1
  Bottom 0.406: SJ3.2 4.47,35.97 4.88,35.56 5.89,35.56 6.1,35.36 6.1,34.7 U2.P3
N$2
  Bottom 0.203: C13.2 R5.1 6.67,42.54 Q1.+
N$3
  Bottom 0.406: SJ3.1 5.28,38.77 R6.1
N$4
  Bottom 0.203: RN9.5 10.55,29.04 10.77,29.26 10.77,34.34 10.43,34.68 U2.P4
  Bottom 0.406: R8.1 8.74,35.56 8.94,35.36 8.94,34.7 U2.P4
N$5
  Bottom 0.406: SJ2.3 2.27,31.05 C15.1
N$6
  Bottom 0.203: RN9.4 5.71,29.04 5.28,29.46 5.28,32.75
  Bottom 0.406: R9.2 2.44,34.34 2.23,34.14 SJ2.1 2.27,32.75 C15.2 5.28,32.75 6.09,32.75 U2.P1
N$7
  Bottom 0.406: C13.1 R6.2 3.66,38.77 SJ3.3
N$8
  Bottom 0.4: T8.3 45.22,43.8 D2.P$1
N$9
  Bottom 0.406: 91.85,25.6 SJ1.3
  Bottom 1.27: D1.C 92.12,25.88 91.85,25.6
N$10
  Bottom 0.5: U1.3 71.53,46.47 71.08,46.92 68.08,46.92 67.58,46.42
  Bottom 1: 67.58,46.42 L1.1
N$11
  Bottom 0.305: IC2.18 28.28,19.55 26.82,18.09 C10.1
  Bottom 1.016: L2.2 C10.1
N$12
  Bottom 0.4: T7.3 44.82,40.8 D2.P$2
N$13
  Bottom 0.4: D2.P$3 43.99,38.69 43.1,37.8 T6.3
N$14
  Bottom 0.4: T5.3 43.9,34.8 D2.P$4
N$15
  Bottom 0.4: T4.3 18.4,34.8 D2.P$21
N$16
  Bottom 0.4: T3.3 17.94,37.8 D2.P$22
N$17
  Bottom 0.4: T2.3 17.48,40.8 D2.P$23
N$18
  Bottom 0.4: T1.3 19.87,43.77 D2.P$24
N$19
  Bottom 0.4: T9.3 56.87,43.77 D3.P$24
N$20
  Bottom 0.4: T16.3 82.92,43.8 D3.P$1
N$21
  Bottom 0.4: T15.3 82.52,40.8 D3.P$2
N$22
  Bottom 0.4: T14.3 82.06,37.8 D3.P$3
N$23
  Bottom 0.406: T13.3 81.13,34.8 81.48,35.15 81.48,35.76 81.87,36.15 D3.P$4
N$24
  Bottom 0.4: T12.3 56,34.8
  Bottom 0.406: 56,34.8 54.75,36.05 D3.P$21
N$25
  Bottom 0.4: T11.3 55.64,37.8 D3.P$22
N$26
  Bottom 0.4: T10.3 55.18,40.8 D3.P$23
N$27
  Top 0.4: RN4.5 24.32,10.2 22.72,11.8 18.8,11.8 17.05,13.55 D2.P$13 | 48,15.7 54.62,15.7 D3.P$13
  Top 0.406: D2.P$13 17.43,15.44 42.88,15.44 44.5,17.07 46.63,17.07 48,15.7
N$28  (via drill 0.41 pad 0.41)
  Top 0.4: D2.P$12 46.37,15.83 | D3.P$12 77.6,21.18 77.6,27 76.4,28.2 60.8,28.2 60,27.4 60,25.8 59.2,25 59.2,22.2 57.6,20.6 57.6,19.4 56.8,18.6 56.8,17.4 56,16.6
  Top 0.406: RN3.8 44.52,8.53 v43.48,8.53 | 46.37,15.83 47.57,14.63 55.27,14.63 56,15.36 56,16.6
  Bottom 0.406: v43.48,8.53 43.48,9.75 45.31,11.58 45.31,15.76 D2.P$12
N$29
  Top 0.4: RN4.6 23.52,9.8 22.32,11 18.4,11 15.6,13.8 15.6,16.92 D2.P$14 | 47.4,19.6 48.6,18.4 54.72,18.4 D3.P$14
  Top 0.406: D2.P$14 19.16,16.26 42.47,16.26 43.89,17.68 43.89,18.9 44.59,19.6 47.4,19.6
N$30  (via drill 0.41 pad 0.41)
  Top 0.4: D2.P$11 46.83,18.37 | D3.P$11 78.4,22.92 78.4,27.8 77.2,29 60.4,29 59.2,27.8 59.2,26.2 58.4,25.4 58.4,22.6 56.8,21 56.8,19.8 56,19
  Top 0.406: RN3.7 45.43,9.64 v45.11,9.96 | 46.83,18.37 48.13,17.07 55.27,17.07 56,17.8 56,19
  Bottom 0.406: D2.P$11 45.92,18.37 46.74,17.55 46.74,11.58 v45.11,9.96
N$31
  Top 0.4: RN4.7 22.72,9.4 21.92,10.2 18,10.2 14.8,13.4 14.8,18.66 | 49.2,20.8 54.64,20.8 D3.P$15
  Top 0.406: 14.8,18.66 D2.P$15 17.05,20.34 18.29,19.1 18.29,18.49 19.71,17.07 42.06,17.07 43.08,18.09 43.08,19.3 43.89,20.12 43.89,21.54 44.5,22.15 47.85,22.15 49.2,20.8
N$32  (via drill 0.41 pad 0.41)
  Top 0.4: D2.P$10 47.59,20.91 48.9,19.6 55.4,19.6 56,20.2 56,21.4 57.6,23 57.6,25.8 58.4,26.6 58.4,28.2 60,29.8 78,29.8 79.2,28.6 79.2,24.66 D3.P$10
  Top 0.406: RN3.6 46.23,9.65 v46.53,9.96
  Bottom 0.406: D2.P$10 45.25,20.79 47.55,18.49 47.55,10.97 v46.53,9.96
N$33
  Top 0.4: RN4.8 18.35,8.65 14,13 14,20.4 D2.P$16 | 48.3,24.7 49.5,23.5 54.7,23.5 D3.P$16
  Top 0.406: D2.P$16 18.29,24.68 18.29,26.01 19.1,26.82 19.1,28.25 19.91,29.06 19.91,30.28 20.73,31.09 20.73,32.51 23.37,35.15 39.22,35.15 41.45,32.92 41.45,31.7 42.47,30.68 42.47,29.46 43.08,28.85 43.08,27.43 44.09,26.42 44.09,25.2 44.59,24.7 48.3,24.7
N$34  (via drill 0.41 pad 0.41)
  Top 0.4: D2.P$9 48.05,23.45 49.3,22.2 55.6,22.2 56.8,23.4 56.8,26.2 57.6,27 57.6,28.6 59.6,30.6 78.8,30.6 80,29.4 80,26.4 D3.P$9
  Top 0.406: RN3.5 47.75,9.37 v47.75,9.55
  Bottom 0.406: D2.P$9 45.44,23.45 48.36,20.52 48.36,10.16 v47.75,9.55
N$35  (via drill 0.41 pad 0.41)
  Top 0.4: 49.8,25.9 54.66,25.9 D3.P$17
  Top 0.406: v57.1,9.75 57.1,9.42 RN2.5 | 49.8,25.9 48.47,27.23 44.5,27.23 43.89,27.84 43.89,29.26 43.28,29.87 43.28,31.09 42.27,32.11 42.27,33.33 39.62,35.97 22.96,35.97 19.91,32.92 19.91,31.5 19.1,30.68 19.1,29.46 18.29,28.65 18.29,27.23 D2.P$17
  Bottom 0.4: 53.2,15 53.2,25 54.19,25.99 D3.P$17
  Bottom 0.406: 53.2,15 53.2,11.62 53.65,11.18 55.68,11.18 v57.1,9.75
N$36  (via drill 0.41 pad 0.18)
  Top 0.4: D2.P$8 48.51,25.99 49.8,24.7 55.3,24.7 56,25.4 56,26.6 56.8,27.4 56.8,29 59.2,31.4 79.6,31.4 80.8,30.2 80.8,27 81.81,25.99 D3.P$8
  Top 0.406: RN1.8 79.34,8.65 v79.25,8.74
  Bottom 0.4: 84.4,13 84.4,24.54 D3.P$8
  Bottom 0.406: 84.4,13 84.4,12.67 83.52,11.79 80.06,11.79 79.25,10.97 v79.25,8.74
N$37  (via drill 0.41 pad 0.41)
  Top 0.4: 48.6,29.8 49.8,28.6 54.68,28.6 D3.P$18
  Top 0.406: v55.47,9.96 55.52,9.91 RN2.6 | D2.P$18 18.29,29.77 18.29,31.09 19.1,31.9 19.1,33.33 22.55,36.78 40.03,36.78 43.08,33.73 43.08,32.51 44.09,31.5 44.09,30.28 44.57,29.8 48.6,29.8
  Bottom 0.4: 52.4,14.6 52.4,27.4 53.53,28.53 D3.P$18
  Bottom 0.406: 52.4,14.6 52.4,11.2 53.24,10.36 55.07,10.36 v55.47,9.96
N$38  (via drill 0.41 pad 0.18)
  Top 0.4: D2.P$7 48.67,28.53 | D3.P$7 82.47,28.53 81.6,29.4 81.6,31 80.4,32.2 58.8,32.2 56,29.4
  Top 0.406: 48.67,28.53 49.97,27.23 55.27,27.23 56,27.96 56,29.4 | v80.26,9.75 81.48,9.75 81.7,9.54 RN1.7
  Bottom 0.4: 85.2,12.6 85.2,26.28 D3.P$7
  Bottom 0.406: 85.2,12.6 85.2,11.85 84.12,10.77 80.87,10.77 80.26,10.16 v80.26,9.75
N$39  (via drill 0.41 pad 0.41)
  Top 0.4: 48.9,32.2 50.1,31 54.68,31 D3.P$19
  Top 0.406: RN2.7 54.72,9.29 54.46,9.55 52.43,9.55 v52.02,9.96 | D2.P$19 18.29,32.3 18.29,33.73 22.15,37.59 40.44,37.59 43.89,34.14 43.89,32.92 44.61,32.2 48.9,32.2
  Bottom 0.4: 51.6,14.2 51.6,29.8 52.87,31.07 D3.P$19
  Bottom 0.406: v52.02,9.96 51.6,10.38 51.6,14.2
N$40  (via drill 0.41 pad 0.18)
  Top 0.4: D2.P$6 48.53,31.07 49.8,29.8 55.2,29.8 58.4,33 81.02,33 D3.P$6
  Top 0.406: RN1.6 82.5,9.34 82.91,9.75 v84.12,9.75
  Bottom 0.4: 86,12.2 86,28.02 D3.P$6
  Bottom 0.406: 86,12.2 86,10.61 85.14,9.75 v84.12,9.75
N$41  (via drill 0.41 pad 0.41)
  Top 0.4: 49.2,34.9 50.4,33.7 54.66,33.7 D3.P$20
  Top 0.406: RN2.8 51.7,8.65 v51.21,9.14 | D2.P$20 21.85,38.41 40.84,38.41 44.35,34.9 49.2,34.9
  Bottom 0.4: 50.8,13.8 50.8,32.2 52.21,33.61 D3.P$20
  Bottom 0.406: v51.21,9.14 50.8,9.55 50.8,13.8
N$42  (via drill 0.41 pad 0.18)
  Top 0.4: D2.P$5 48.99,33.61 50.4,32.2 55.5,32.2 57.1,33.8 82.76,33.8 D3.P$5
  Top 0.406: RN1.5 83.39,8.74 v84.94,8.74
  Bottom 0.4: 86.8,11.8 86.8,29.76 D3.P$5
  Bottom 0.406: 86.8,11.8 86.8,9.79 85.75,8.74 v84.94,8.74
N$43  (via drill 0.41 pad 0.18)
  Top 1.016: BATT1.+ 92.05,40.55 v92.05,41.45
  Bottom 1.016: v92.05,41.45 92.05,40.31 S1.2
N$44
  Bottom 0.203: IC1.64 76.81,17.82 76.81,6.71 77.67,5.85 SW1.3
N$45
  Bottom 0.203: IC1.63 75.2,21.34 75.39,21.34 77.22,19.51 77.22,6.91 77.83,6.3 89.61,6.3 90.02,6.71 96.72,6.71 97.58,5.85 SW1.4
N$46
  Bottom 0.203: IC1.62 75.04,21.74 75.59,21.74 77.62,19.71 77.62,7.11 78.03,6.71 89.41,6.71 90.5,7.8 SW1.5
N$47
  Bottom 0.203: IC1.60 74.73,22.55 76,22.55 78.44,20.12 78.44,7.72 78.64,7.52 88.59,7.52 90.82,9.75 SW1.2
N$48
  Bottom 0.203: IC1.61 74.89,22.15 75.79,22.15 78.03,19.91 78.03,7.32 78.23,7.11 89,7.11 90.63,8.74 96.93,8.74 97.94,9.75 SW1.1
N$49
  Top 0.406: RN4.4 24.38,6.89 24.38,6.71 24.79,6.3 33.33,6.3 34,5.62 T32.3
N$50
  Bottom 0.305: IC2.7 34.58,19.55 35.43,20.4 Y1.1
N$51
  Bottom 0.305: IC2.8 33.55,18.06 34.22,17.4 Y1.3
N$52
  Bottom 1.016: S1.1 94.25,39.01 97.69,39.01 JP7.1
N$60
  Top 0.406: RN4.3 23.52,5.94 23.98,5.49 29.67,5.49 30.07,5.08 30.07,3.97 T31.3
N$61
  Top 0.406: RN4.2 22.72,5.12 23.16,4.67 25.6,4.67 26.01,4.27 T30.3
N$62
  Top 0.406: RN4.1 22,6.87 T29.3
N$63
  Top 0.406: RN3.4 47.03,5.6 47.35,5.28 49.78,5.28 49.99,5.08 49.99,3.91 T28.3
N$64
  Top 0.406: RN3.3 46.23,5.39 46,5.16 T27.3
N$65
  Top 0.406: RN3.2 45.43,5.8 44.91,5.28 42.27,5.28 42,5.02 T26.3
N$66
  Top 0.406: RN3.1 44.63,6.43 44.3,6.1 38.41,6.1 38,5.69 T25.3
N$67
  Top 0.406: RN2.4 56.97,6.3 65.43,6.3 66,5.73 T24.3
N$68
  Top 0.406: RN2.3 55.52,6.05 56.08,5.49 61.37,5.49 62,4.85 T23.3
N$69
  Top 0.406: RN2.2 54.72,5.22 55.27,4.67 57.71,4.67 58,4.38 T22.3
N$70
  Top 0.406: RN2.1 53.92,3.97 T21.3
N$71
  Top 0.406: RN1.4 83.3,5.27 82.91,4.88 82.3,4.88 82,4.58 T20.3
N$72
  Top 0.406: RN1.3 82.5,5.89 82.09,5.49 81.48,5.49 80.87,4.88 78.23,4.88 78,4.64 T19.3
N$73
  Top 0.406: RN1.2 81.7,6.31 81.48,6.1 81.08,6.1 80.47,5.49 74.37,5.49 74,5.12 T18.3
N$74
  Top 0.406: RN1.1 80.05,6.1 70.31,6.1 70,5.79 T17.3
RED_ROW_FROM_CPU_DATA  (via drill 0.41 pad 0.18, 0.41 pad 0.41)
  Top 0.203: v30.48,12.8 30.89,12.39 56.69,12.39 60.96,16.66 v60.96,19.71
  Bottom 0.203: IC1.35 63.13,21.74 62.59,21.74 60.96,20.12 v60.96,19.71 | IC2.13 30.95,13.88 30.48,13.41 v30.48,12.8
ROW1G  (via drill 0.41)
  Top 0.2: T17.1 69.05,2.75
  Top 0.203: 69.05,2.75 68.68,3.12 v68.68,3.45
  Bottom 0.203: IC1.4 75.18,15.35 75.18,8.74 69.9,3.45 v68.68,3.45
ROW1R  (via drill 0.41)
  Top 0.2: T21.1 53.05,2.75
  Top 0.203: 53.05,2.75 52.63,3.17 v52.63,3.25
  Bottom 0.203: IC1.10 73.56,13.58 73.56,9.96 71.93,8.33 65.02,8.33 61.77,5.08 58.52,5.08 58.12,4.67 55.27,4.67 53.85,3.25 v52.63,3.25
ROW2G  (via drill 0.41)
  Top 0.2: T18.1 73.05,2.75
  Top 0.203: 73.05,2.75 72.81,2.98 v72.81,3.19
  Bottom 0.203: IC1.3 75.59,15.51 75.59,7.39 72.81,4.61 v72.81,3.19
ROW2R  (via drill 0.41)
  Top 0.2: T22.1 57.05,2.75
  Top 0.203: 57.05,2.75 56.69,3.1 v56.69,3.25
  Bottom 0.203: IC1.9 73.97,13.74 73.97,9.55 72.34,7.92 65.43,7.92 62.18,4.67 59.33,4.67 57.91,3.25 v56.69,3.25
ROW3G  (via drill 0.41)
  Top 0.2: v76.61,3.25 77.05,2.75 T19.1
  Bottom 0.203: IC1.2 76,15.67 76,3.8 76.55,3.25 v76.61,3.25
ROW3R  (via drill 0.41)
  Top 0.2: T23.1 61.05,2.75
  Top 0.203: 61.05,2.75 v60.55,3.24 v60.55,3.25
  Bottom 0.203: IC1.7 74.37,14.46 74.37,9.14 72.75,7.52 65.84,7.52 61.57,3.25 v60.55,3.25
ROW4G  (via drill 0.41)
  Top 0.2: 81.05,2.75 T20.1
  Top 0.203: 81.05,2.75 81.05,2.87 v80.67,3.25
  Bottom 0.203: IC1.1 76.4,15.82 76.4,4.67 77.83,3.25 v80.67,3.25
ROW4R  (via drill 0.41)
  Top 0.2: T24.1 65.05,2.75
  Top 0.203: 65.05,2.75 64.62,3.18 v64.62,3.45
  Bottom 0.203: IC1.5 74.78,15.19 74.78,8.94 70.51,4.67 67.67,4.67 66.45,3.45 v64.62,3.45
ROW5G  (via drill 0.41)
  Top 0.2: T28.1 49.05,2.75
  Top 0.203: 49.05,2.75 48.77,3.03 v48.77,3.25
  Bottom 0.203: IC1.11 73.15,13.42 73.15,10.36 71.53,8.74 64.62,8.74 61.37,5.49 58.12,5.49 57.71,5.08 54.86,5.08 54.46,4.67 51.61,4.67 50.19,3.25 v48.77,3.25
ROW5R  (via drill 0.41)
  Top 0.2: T29.1 21.05,2.75
  Top 0.203: 21.05,2.75 20.73,3.07 v20.73,3.25
  Bottom 0.203: IC1.22 63.19,11.58 61.77,11.58 58.52,8.33 55.27,8.33 54.86,7.92 52.02,7.92 51.61,7.52 48.77,7.52 48.36,7.11 45.11,7.11 44.7,6.71 41.45,6.71 41.05,6.3 37.8,6.3 37.39,5.89 34.14,5.89 33.73,5.49 30.89,5.49 30.48,5.08 26.82,5.08 26.42,4.67 23.57,4.67 22.15,3.25 v20.73,3.25
ROW6G  (via drill 0.41)
  Top 0.2: T27.1 45.05,2.75
  Top 0.203: 45.05,2.75 44.7,3.09 v44.7,3.25
  Bottom 0.203: IC1.12 72.75,13.26 72.75,10.77 71.12,9.14 64.21,9.14 60.96,5.89 57.71,5.89 57.3,5.49 54.46,5.49 54.05,5.08 51.21,5.08 50.8,4.67 47.55,4.67 46.13,3.25 v44.7,3.25
ROW6R  (via drill 0.41)
  Top 0.2: T30.1 25.05,2.75
  Top 0.203: 25.05,2.75 24.59,3.21 v24.59,3.25
  Bottom 0.203: IC1.21 63.35,11.18 62.18,11.18 58.93,7.92 55.68,7.92 55.27,7.52 52.43,7.52 52.02,7.11 49.17,7.11 48.77,6.71 45.52,6.71 45.11,6.3 41.86,6.3 41.45,5.89 38.2,5.89 37.8,5.49 34.54,5.49 34.14,5.08 31.29,5.08 30.89,4.67 27.23,4.67 25.81,3.25 v24.59,3.25
ROW7G  (via drill 0.41)
  Top 0.2: T26.1 41.05,2.75
  Top 0.203: 41.05,2.75 40.64,3.16 v40.64,3.25
  Bottom 0.203: IC1.13 72.34,13.1 72.34,11.18 70.71,9.55 63.8,9.55 60.55,6.3 57.3,6.3 56.9,5.89 54.05,5.89 53.65,5.49 50.8,5.49 50.39,5.08 47.14,5.08 46.74,4.67 43.48,4.67 42.06,3.25 v40.64,3.25
ROW7R  (via drill 0.41)
  Top 0.2: T31.1 29.05,2.75
  Top 0.203: 29.05,2.75 28.65,3.15 v28.65,3.25
  Bottom 0.203: IC1.20 63.51,10.77 62.59,10.77 59.33,7.52 56.08,7.52 55.68,7.11 52.83,7.11 52.43,6.71 49.58,6.71 49.17,6.3 45.92,6.3 45.52,5.89 42.27,5.89 41.86,5.49 38.61,5.49 38.2,5.08 34.95,5.08 34.54,4.67 31.7,4.67 30.28,3.25 v28.65,3.25
ROW8G  (via drill 0.41)
  Top 0.2: T25.1 37.05,2.75
  Top 0.203: 37.05,2.75 36.58,3.22 v36.58,3.25
  Bottom 0.203: IC1.18 63.82,9.96 63.4,9.96 60.15,6.71 56.9,6.71 56.49,6.3 53.65,6.3 53.24,5.89 50.39,5.89 49.99,5.49 46.74,5.49 46.33,5.08 43.08,5.08 42.67,4.67 39.42,4.67 38,3.25 v36.58,3.25
ROW8R  (via drill 0.41)
  Top 0.2: T32.1 33.05,2.75
  Top 0.203: 33.05,2.75 32.72,3.08 v32.72,3.25
  Bottom 0.203: IC1.19 63.66,10.36 62.99,10.36 59.74,7.11 56.49,7.11 56.08,6.71 53.24,6.71 52.83,6.3 49.99,6.3 49.58,5.89 46.33,5.89 45.92,5.49 42.67,5.49 42.27,5.08 39.01,5.08 38.61,4.67 35.36,4.67 33.93,3.25 v32.72,3.25
ROW_ENABLE_FROM_CPU  (via drill 0.41 pad 0.18, 0.41 pad 0.41)
  Top 0.203: v32.51,13.61 32.92,13.21 56.29,13.21 59.33,16.26 v59.33,19.71
  Bottom 0.203: IC1.37 63.45,22.55 62.18,22.55 v59.33,19.71 | IC2.11 31.95,14.18 v32.51,13.61
ROW_FROM_CPU_CLK  (via drill 0.41 pad 0.18, 0.41 pad 0.41)
  Top 0.203: v29.46,12.39 29.87,11.99 56.9,11.99 61.77,16.87 v61.77,18.9
  Bottom 0.203: IC1.34 62.97,21.34 62.79,21.34 61.77,20.32 v61.77,18.9 | IC2.14 30.45,13.99 29.46,13.01 v29.46,12.39
RXD
  Bottom 0.203: JP5.2 15.65,38.46 15.65,30.07 16.05,29.67 17.68,29.67 18.69,28.65 31.5,28.65 31.95,28.2 IC2.30
SCK
  Bottom 0.203: IC2.17 28.85,14.22 25.81,11.18 14.02,11.18 12.19,13.01 12.19,19.1 8.74,22.55 7.22,22.55 JP2.P$3
SCL
  Bottom 0.203: IC2.28 30.95,23.91 30.07,24.79 20.52,24.79 17.88,27.43 16.46,27.43 15.65,28.25 15.65,29.46 15.04,30.07 14.83,30.07 14.43,30.48 JP4.1
  Bottom 0.406: R10.1 13.32,32.35 JP4.1
SDA
  Bottom 0.203: JP4.2 16.1,27.03 17.68,27.03 20.32,24.38 29.87,24.38 30.45,23.8 IC2.27
  Bottom 0.406: R11.1 13.32,27.6 JP4.2
TCK  (via drill 0.41 pad 0.18)
  Top 0.203: JP1.P$1 92.46,16.66 86.77,10.97 78.44,10.97 78.23,10.77 68.28,10.77 v67.87,11.18
  Bottom 0.203: JP1.P$1 94.28,15.9 94.28,14.22 94.69,13.82 R1.1 | IC1.16 69.92,13.82 69.09,13.82 67.87,12.6 v67.87,11.18
TDI  (via drill 0.41 pad 0.18)
  Top 0.203: JP1.P$9 93.27,25.04 93.27,17.68 93.07,17.48 92.05,17.48 86.36,11.79 78.03,11.79 77.83,11.58 70.1,11.58 69.49,12.19 v69.49,12.8
  Bottom 0.203: IC1.15 71.53,12.78 71.53,12.6 71.12,12.19 70.1,12.19 v69.49,12.8 | JP1.P$9 93.27,25.04 93.27,23.77 92.9,23.41 R2.1
TDO  (via drill 0.41 pad 0.18)
  Top 0.203: JP1.P$3 96.32,17.93 96.32,15.85 95.71,15.24 91.64,15.24 86.97,10.57 78.64,10.57 78.44,10.36 v67.06,10.36
  Bottom 0.203: IC1.17 67.06,12.62 v67.06,10.36
TMS  (via drill 0.41 pad 0.18)
  Top 0.203: JP1.P$5 93.67,20.37 93.67,17.48 93.27,17.07 92.25,17.07 86.56,11.38 78.23,11.38 78.03,11.18 69.09,11.18 68.68,11.58 v68.68,11.99
  Bottom 0.203: IC1.14 71.93,12.94 71.93,12.39 71.32,11.79 68.89,11.79 v68.68,11.99 | JP1.P$5 93.67,20.37 93.67,19.1 93.23,18.66 R3.1
TXD
  Bottom 0.203: JP5.1 16.05,40.59 16.05,30.28 16.26,30.07 17.88,30.07 18.9,29.06 31.7,29.06 32.45,28.31 IC2.31
USER_BUTTON  (via drill 0.41 pad 0.18)
  Top 0.203: v10.16,15.65 12.6,15.65 13.41,16.46 13.41,20.73 15.85,23.16 15.85,24.38 v16.26,24.79 | v21.81,21.7 19.94,23.57 v19.91,23.57
  Bottom 0.203: IC2.23 22.16,22.05 v21.81,21.7 | v10.16,15.65 4.1,15.65 S2.1 | v19.91,23.57 18.69,24.79 v16.26,24.79
USER_IO_1
  Bottom 0.203: IC2.1 33.55,23.55 33.33,23.77 33.33,28.65 32.11,29.87 27.64,29.87 27.23,30.28 JP6.3
USER_IO_2
  Bottom 0.203: JP6.4 29.77,30.58 30.07,30.28 32.31,30.28 33.73,28.85 33.73,23.98 34.34,23.37 34.34,22.35 34.04,22.05 IC2.2
USER_IO_32
  Bottom 0.203: IC2.32 32.92,23.18 32.92,28.45 31.9,29.46 24.99,29.46 24.69,29.77 JP6.2
VCC  (via drill 0.41, 0.41 pad 0.18)
  Top 0.406: JP2.P$2 12.36,18.26 12.8,18.69 12.8,26.21 | JP4.3 12.85,26.16 12.8,26.21 | 12.8,26.21 12.8,30.07 | 12.8,30.07 12.8,37.19 | JP5.3 12.85,37.13 12.8,37.19 | 12.8,30.07 v13.21,30.07 | 12.8,37.19 12.8,42.88 17.88,47.95 | v20.12,27.84 22.15,29.87 JP6.1 22.15,32.72 23.57,34.14 v30.89,34.14 32.92,34.14 37.59,29.46 v37.59,27.84 | C6.1 62.79,23.77 v62.59,23.77 | C5.1 64.21,13.41 v64.01,13.41 | C8.1 v74.78,24.79 | C7.1 72.03,17.98 v72.03,17.58 | JP3.2 25.4,20.32 v23.37,18.29
  Top 0.61: JP1.P$4 99.16,20.78 99.16,27.64 v98.75,28.04 98.35,28.45 94.28,28.45 90.42,24.59 v90.42,20.93 90.42,16.87 86.16,12.6 80.67,12.6 | v76.2,47.35 75.59,47.95 30.89,47.95 | 30.89,47.95 17.88,47.95 | 30.89,47.95 v30.89,47.35 | v30.89,45.11 v30.89,43.28 | 80.67,12.6 71.32,12.6 69.9,14.02 68.48,14.02 67.26,12.8 64.62,12.8 v64.01,13.41 | 80.67,12.6 80.67,13.82 79.86,14.63 74.98,14.63 v72.03,17.58 73.36,18.9 73.36,21.54 74.78,22.96 v74.78,24.79 73.36,26.21 63.8,26.21 62.59,24.99 v62.59,23.77
  Bottom 0.203: R4.2 30.89,28.04 30.68,28.25 27.43,28.25 JP3.2 | R3.2 92.05,20.93 R2.2 | IC1.39 63.36,23.77 v62.59,23.77 | IC1.6 72.03,17.36 v72.03,17.58 | IC1.23 64.45,13.41 v64.01,13.41 | IC1.57 74.78,24.3 v74.78,24.79
  Bottom 0.305: IC2.6 34.27,20.05 34.66,20.44 34.66,21.05 | IC2.4 34.66,21.05 | 34.66,21.05 34.95,21.34 37.39,21.34 37.6,21.55 C16.1 | C12.1 37.6,27.82 v37.59,27.84 | L2.1 23.81,15.61 23.37,16.05 v23.37,18.29
  Bottom 0.406: R10.2 11.79,30.07 | 11.79,30.07 R11.2 | v13.21,30.07 11.79,30.07 | v20.12,27.84 23.77,27.84 JP3.2
  Bottom 0.61: SJ1.2 v90.42,20.93 92.05,20.93 | v98.75,28.04 99.57,28.85 99.57,46.74 98.35,47.95 76.81,47.95 v76.2,47.35 | v30.89,47.35 v30.89,45.11 | v30.89,43.28 v30.89,34.14
  Bottom 1: C11.1 C16.1
  Bottom 1.016: C12.1 C11.1

### Text on the board
Top: + | - | LED Matrix | Badge | Rev A | 2013-09-23
bPlace: CHG | ON | /OFF | + | - | vancouver.hackspace.ca